# Altium schematic sheet dBFS Conditioning.SchDoc
size A4
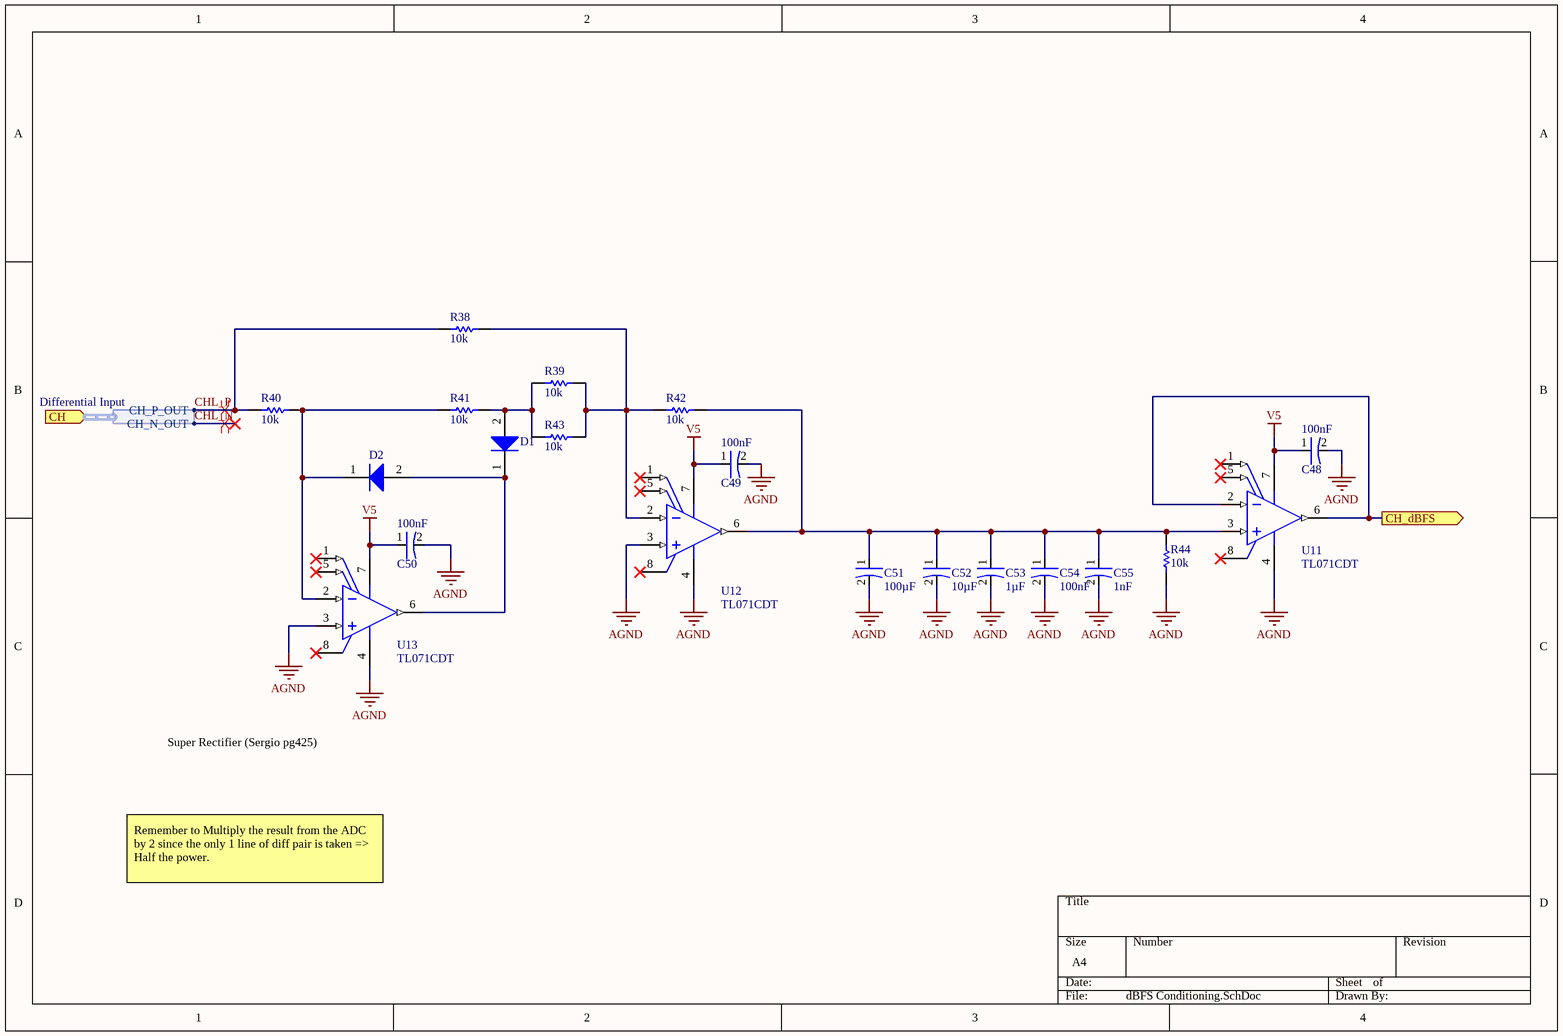
[diagram p0: dBFS Conditioning.SchDoc]

## Parts
C48  value 100nF  [0805-M]  (hidden comment: CAP 0.1uF CER 0805 50V  X7R 5%)
C49  value 100nF  [0805-M]  (hidden comment: CAP 0.1uF CER 0805 50V  X7R 5%)
C50  value 100nF  [0805-M]  (hidden comment: CAP 0.1uF CER 0805 50V  X7R 5%)
C51  value 100µF  [1210-M]  (hidden comment: CAP 100uF CER 1210 16V X5R 20%)
C52  value 10µF  [0805-M]  (hidden comment: CAP 10uF CER 0805 25V X5R 10%)
C53  value 1µF  [0805-M]  (hidden comment: CAP 1uF CER 0805 25V C0G 10%)
C54  value 100nF  [0805-M]  (hidden comment: CAP 0.1uF CER 0805 50V  X7R 5%)
C55  value 1nF  [0805-M]  (hidden comment: CAP 1nF CER 0805 25V X7R 5%)
D1  1N4148W-7-F  [SODFL370X135-2M]  (value not drawn)
D2  1N4148W-7-F  [SODFL370X135-2M]  (value not drawn)
R38  value 10k  [0805-M]  (hidden comment: RES 10k 0805 125mW 1%)
R39  value 10k  [0805-M]  (hidden comment: RES 10k 0805 125mW 1%)
R40  value 10k  [0805-M]  (hidden comment: RES 10k 0805 125mW 1%)
R41  value 10k  [0805-M]  (hidden comment: RES 10k 0805 125mW 1%)
R42  value 10k  [0805-M]  (hidden comment: RES 10k 0805 125mW 1%)
R43  value 10k  [0805-M]  (hidden comment: RES 10k 0805 125mW 1%)
R44  value 10k  [0805-M]  (hidden comment: RES 10k 0805 125mW 1%)
U11  TL071CDT  [SOP127P600X175-8N]
U12  TL071CDT  [SOP127P600X175-8N]
U13  TL071CDT  [SOP127P600X175-8N]

## Ports
CH (in, harness Differential Input), CH_dBFS (out)

## Harnesses
Differential Input: CH_P_OUT, CH_N_OUT

## Nets
AGND: C48.2(Cathode) C49.2(Cathode) C50.2(Cathode) C51.2(Cathode) C52.2(Cathode) C53.2(Cathode) C54.2(Cathode) C55.2(Cathode) R44.1 U11.4(V-) U12.3(Non_Inverting_Input) U12.4(V-) U13.3(Non_Inverting_Input) U13.4(V-)
V5: C48.1(Anode) C49.1(Anode) C50.1(Anode) U11.7(V+) U12.7(V+) U13.7(V+)
CH_dBFS: U11.2(Inverting_Input) U11.6(OUT) ; port CH_dBFS
CHL_N: port CH.CH_N_OUT
CHL_P: R38.1 R40.1 ; port CH.CH_P_OUT
NetC51_1: C51.1(Anode) C52.1(Anode) C53.1(Anode) C54.1(Anode) C55.1(Anode) R42.2 R44.2 U11.3(Non_Inverting_Input) U12.6(OUT)
NetD1_1: D1.1 D2.2 U13.6(OUT)
NetD1_2: D1.2 R39.1 R41.2 R43.1
NetD2_1: D2.1 R40.2 R41.1 U13.2(Inverting_Input)
NetR38_2: R38.2 R39.2 R42.1 R43.2 U12.2(Inverting_Input)

Not connected (* = marked no-connect by the designer): U11 1(Offset_Null_1)* 5(Offset_Null_2)* 8(NC)*; U12 1(Offset_Null_1)* 5(Offset_Null_2)* 8(NC)*; U13 1(Offset_Null_1)* 5(Offset_Null_2)* 8(NC)*

## Layout directives
differential pair: CHL_N, CHL_P

## Notes on the sheet
- Super Rectifier (Sergio pg425)
- Remember to Multiply the result from the ADC by 2 since the only 1 line of diff pair is taken => Half the power.

## Library data of the parts
C48-C50 C54 = CAP 0.1uF CER 0805 50V  X7R 5%-2: CAP-0.1uF-CER-0805-50V- X7R-5%; Manufacturer: Generic; Bin: F1-C6-4; Type: SMD; Design Item ID: CAP 0.1uF CER 0805 50V  X7R 5%; Supplier 1: Mouser; Datasheet: http://www.kemet.com/Lists/ProductCatalog/Attachments/53/KEM_C1002_X7R_SMD.pdf; Source: Capacitor Library.SchLib; Case/Package: 0805; Status: Active; Supplier Part Number 1: 80-C0805C104J3R
C51 = CAP 100uF CER 1210 16V X5R 20%-2: CAP-100uF-CER-1210-16V-X5R-20%; Manufacturer: Generic; Bin: F1-C5-1 / F1-C2-8; Type: SMD; Case/Package: 1210; Supplier 1: Digi-Key; Source: Capacitor Library.SchLib; Design Item ID: CAP 100uF CER 1210 16V X5R 20%; Status: Active; Supplier Part Number 1: 587-3152-6-ND
C52 = CAP 10uF CER 0805 25V X5R 10%-2: CAP-10uF-CER-0805-25V-X5R-10%; Manufacturer: Generic; Type: SMD; Bin: F1-C1-4; Supplier 1: Mouser; Case/Package: 0805; Source: Capacitor Library.SchLib; Supplier Part Number 1: 80-C0805C106K8P; Status: Active; Design Item ID: CAP 10uF CER 0805 25V X5R 10%
C53 = CAP 1uF CER 0805 25V C0G 10%-2: Manufacturer: Generic; Type: SMD; Bin: N; Source: Capacitor Library.SchLib; Design Item ID: CAP 1uF CER 0805 25V C0G 10%; Supplier 1: Mouser; Supplier Part Number 1: 810-C2012X5R1E105K; Status: Active; Case/Package: 0805
C55 = CAP 1nF CER 0805 25V X7R 5%-2: Manufacturer: Generic; Bin: N; Type: SMD; Source: Capacitor Library.SchLib; Datasheet: http://www.mouser.com/ds/2/212/KEM_C1002_X7R_SMD-357932.pdf; Supplier 1: Mouser; Status: Active; Design Item ID: CAP 1nF CER 0805 25V X7R 5%; Supplier Part Number 1: 77-VJ0805Y102JXXPBC; Case/Package: 0805
D1 D2 = 1N4148W-7-F-1: DIODE-SMT-1.25V-100V-0.15A-1N4148; Manufacturer: Vishay; Bin: F2-DM1-3; Type: SMD; Case/Package: SOD-123; Supplier Part Number 1: 1N4148W-FDIDKR-ND; Design Item ID: 1N4148W-7-F; Supplier 1: Digi-Key; Source: Diode Library.SchLib; Status: Active
R38-R44 = RES 10k 0805 125mW 1%-1: RES-10k-0805-125mW-1%; Manufacturer: Generic; MAPPING: 1(2,1,10k); Bin: F1-R12-10; Design Item ID: RES 10k 0805 125mW 1%; Case/Package: 0805; Type: SMD; Status: Active; Source: Resistor Library.SchLib
U11-U13 = CMP-01297-2: IC OPAMP JFET 4MHZ 8SO; Manufacturer: STMicroelectronics; Bin: NR; Case/Package: 8-pin SO; Type: SMD; Status: NR; Supllier Part Number1: NR; Supplier1: NR